# EAGLE design 8pin-CC1101-Adapter (EAGLE 9.6.2)
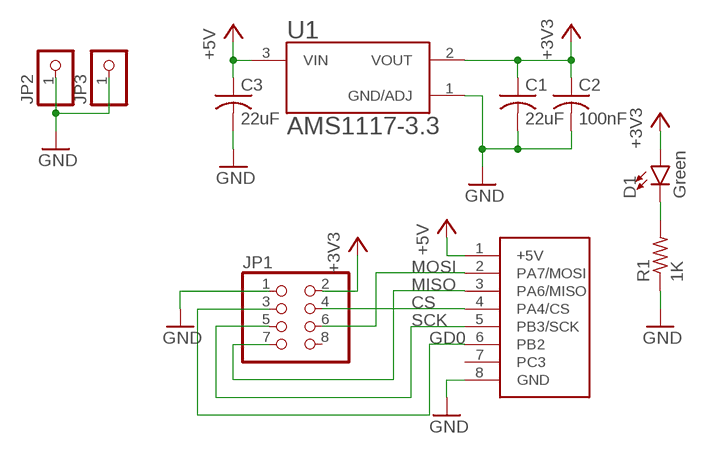
[diagram p0: schematic, sheet 1]

## Parts
C1  22uF  C-USC3216  [C3216]
C2  100nF  C-USC0805  [C0805]
C3  22uF  C-USC3216  [C3216]
D1  Green  LED-GREEN0603  [LED-0603]
JP1  PINHD-2X4  [2X04]
JP2  PINHD-1X1  [1X01]
JP3  PINHD-1X1  [1X01]
R1  1K  R-US_R0603  [R0603]
U1  AMS1117-3.3  [SOT229P700X180-4N]
U$1  LEFT-H1-SMD  [LEFT-H1-SMD]

## Nets
+3V3: C1.1 C2.1 D1.A JP1.2 U1.2(VOUT)
+5V: C3.1 U1.3(VIN) U$1.1(+5V)
CS: JP1.4 U$1.4(PA4/CS)
GD0: JP1.3 U$1.6(PB2)
GND: C1.2 C2.2 C3.2 JP1.1 JP2.1 JP3.1 R1.1 U1.1(GND/ADJ) U$1.8(GND)
MISO: JP1.7 U$1.3(PA6/MISO)
MOSI: JP1.6 U$1.2(PA7/MOSI)
N$1: D1.C R1.2
SCK: JP1.5 U$1.5(PB3/SCK)
Unconnected: JP1.8 U$1.7(PC3)

## Library data of the parts
C1-C3 = rcl:C-US: CAPACITOR, American symbol; SPICEPREFIX: C
D1 = SparkFun-LED:LED-GREEN: Green SMD LED Used in manufacturing of various products at SparkFun Packages: 0603 - SMD 0603 package [Product Link] <http://www.futureelectronics.com/en/technologies/semiconductors/optoelectronics/leds/Pages/9894312-LTST-C190GKT.aspx?CrossPart=HSMG-C190&IM=0> LilyPad 1206 - SMD1206 LilyPad package [Product Link] <http://www.futureelectronics.com/en/Technologies/Product.aspx?ProductID=IN150NGHARVATEKCORPORATION2049943&IM=0> 1206 - SMD1206 package [Product Link] <http://www.futureelectronics.com/en/technologies/semiconductors/optoelectronics/leds/Pages/8315665-LTST-C150KGKT.aspx?IM=0> 1206 Bottom Mount -SMD 1206 Bottom Mount [Product Link] <http://www.digikey.com/product-detail/en/lite-on-inc/LTST-C230KGKT/160-1456-1-ND/386854> SparkFun Products: Pro Mini 328 -5V <https://www.sparkfun.com/products/821> RedBoard <https://www.sparkfun.com/products/12757> MP3 Trigger <https://www.sparkfun.com/products/13720> Makey Makey <https://www.sparkfun.com/products/11076>; PROD_ID: DIO-00821
JP1 = pinhead:PINHD-2X4: PIN HEADER
JP2 JP3 = pinhead:PINHD-1X1: PIN HEADER
R1 = rcl:R-US_: RESISTOR, American symbol; SPICEPREFIX: R
U1 = AMS1117-3.3:AMS1117-3.3: Check availability <https://pricing.snapeda.com/parts/AMS1117-3.3/Advanced%20Monolithic%20Systems/view-part?ref=eda>; AVAILABILITY: Not in stock; CHECK_PRICES: https://www.snapeda.com/parts/AMS1117-3.3/Advanced+Monolithic+Systems/view-part/?ref=eda; DESCRIPTION: Sot223/Pkg 1-Amp 3.3-Volt Low Drop Out Voltage Regulatator; MF: Advanced Monolithic Systems; MP: AMS1117-3.3; PACKAGE: SOT-223 Seeed Technology; PRICE: None; SNAPEDA_LINK: https://www.snapeda.com/parts/AMS1117-3.3/Advanced+Monolithic+Systems/view-part/?ref=snap
U$1 = Flipper-Zero-GPIO-Headers:LEFT-H1-SMD

## Board
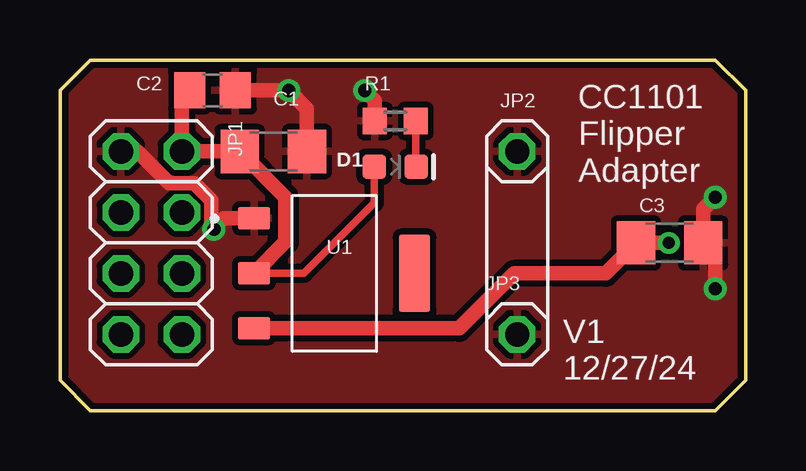
[diagram p1: board, top side]
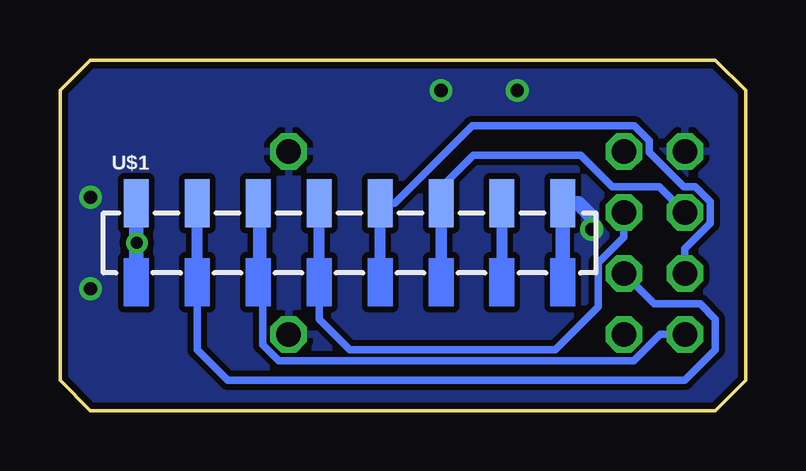
[diagram p2: board, bottom side, seen from below]

Size 28.57 x 14.61 mm. Coordinates in mm from the lower left corner, seen from the top.
Outline: 0,13.34 0,1.27 1.27,0 27.3,0 28.57,1.27 28.57,13.34 27.3,14.61 1.27,14.61 0,13.34
Copper layers (1*16): Top 0.035mm / dielectric 1.5mm / Bottom 0.035mm
Design rules "default *": minimum track width 6mil, minimum drill 0.35mm, track to track 6mil, track to pad 6mil, pad to pad 6mil, via to via 6mil, smd to smd 6mil, copper to edge 10mil, drill to drill 6mil, minimum pad ring 10mil, minimum via ring 8mil, stop-mask expansion 4mil, vias tented up to drill 0mil, thermal gap 10mil

### Footprints (pad centres in the part's own frame; a part is rotated, then mirrored left to right if it is on the bottom)
C3216 = smd 1.6 x 1.8: 1 -1.4,0; 2 1.4,0
C0805 = smd 1.3 x 1.5: 1 -0.95,0; 2 0.95,0
LED-0603 = smd 1 x 1: A -0.877,0; C 0.877,0
2X04 = drill 1.016 octagon: 1 -3.81,-1.27; 2 -3.81,1.27; 3 -1.27,-1.27; 4 -1.27,1.27; 5 1.27,-1.27; 6 1.27,1.27; 7 3.81,-1.27; 8 3.81,1.27
1X01 = drill 1.016 octagon: 1 0,0
R0603 = smd 1 x 1.1: 1 -0.85,0; 2 0.85,0
SOT229P700X180-4N = smd 1.31 x 0.93: 1 -3.345,2.29; 2 -3.345,0; 3 -3.345,-2.29 | smd 1.31 x 3.24: 4 3.345,0
LEFT-H1-SMD = smd 1 x 2: 1 0,1.65; 2 2.54,1.65; 3 5.08,1.65; 4 7.62,1.652; 5 10.16,1.65; 6 12.7,1.652; 7 15.24,1.65; 8 17.78,1.652

### Placement (x,y rotation side)
C1  8.89,10.79 0 top
C2  6.35,13.34 0 top
C3  25.4,6.99 0 top
D1  13.97,10.16 0 top
JP1  3.81,6.99 270 top
JP2  19.05,10.79 0 top
JP3  19.05,3.17 0 top
R1  13.97,12.06 0 top
U1  11.43,5.71 0 top
U$1  25.4,6.99 0 bottom

### Tracks (layer width: path | path; a pad name or v marks a point on that pad's centre or on a via)
+3V3
  Top 0.305: U1.2 10.16,5.71 13.09,8.65 D1.A
  Top 0.61: C2.1 5.08,13.02 JP1.2 C1.1 9.39,8.89 9.39,7.03 U1.2
+5V  (via drill 0.5)
  Top 0.61: U1.3 16.63,3.42 18.92,5.71 22.73,5.71 C3.1 v25.37,6.99
  Bottom 0.61: 25.4,5.08 U$1.1 25.4,7.02 v25.37,6.99
CS
  Bottom 0.305: U$1.4 17.78,3.81 16.51,2.54 7.94,2.54 6.15,4.33 6.15,6.15 5.08,7.22 JP1.4
GD0
  Bottom 0.305: JP1.3 3.61,9.32 5.56,9.32 6.88,10.64 11.36,10.64 12.7,9.3 U$1.6
GND  (via drill 0.55)
  Top 0.61: C2.2 v9.53,13.34 10.29,12.57 C1.2 | R1.1 13.12,12.92 v12.7,13.34 | v6.41,7.55 6.41,7.61 | 6.41,7.61 6.81,8.01 U1.1 | v27.3,8.89 26.8,8.38 C3.2 27.3,6.48 v27.3,5.08 | JP1.1 3.22,10.79 4.54,9.47 5.59,9.47 6.3,8.76 6.3,7.72 6.41,7.61
  Bottom 0.61: v6.41,7.55 6.41,8.07 6.98,8.64 U$1.8 7.62,5.08
  pour Top (isolate 0.254): -0.64,15.24 29.21,15.24 29.21,-0.64 -0.64,-0.64
  pour Bottom (isolate 0.254): -1.27,15.88 29.84,15.88 29.84,-1.27 -1.27,-1.27
MISO
  Bottom 0.305: JP1.7 3.57,3.17 4.66,2.08 19.47,2.08 20.12,2.73 20.12,8.43 U$1.3
MOSI
  Bottom 0.305: JP1.6 3.81,4.45 1.91,4.45 1.27,3.81 1.27,2.54 2.54,1.27 21.59,1.27 22.86,2.54 U$1.2
N$1
  Top 0.305: D1.C 14.82,10.19 R1.2
SCK
  Bottom 0.305: U$1.5 14.63,8.63 11.41,11.86 4.64,11.86 4.01,11.24 4.01,10.76 2.58,9.32 2.1,9.32 1.47,8.7 1.47,7.81 2.54,6.75 JP1.5

### Text on the board
tPlace: CC1101 / Flipper / Adapter | V1 / 12/27/24